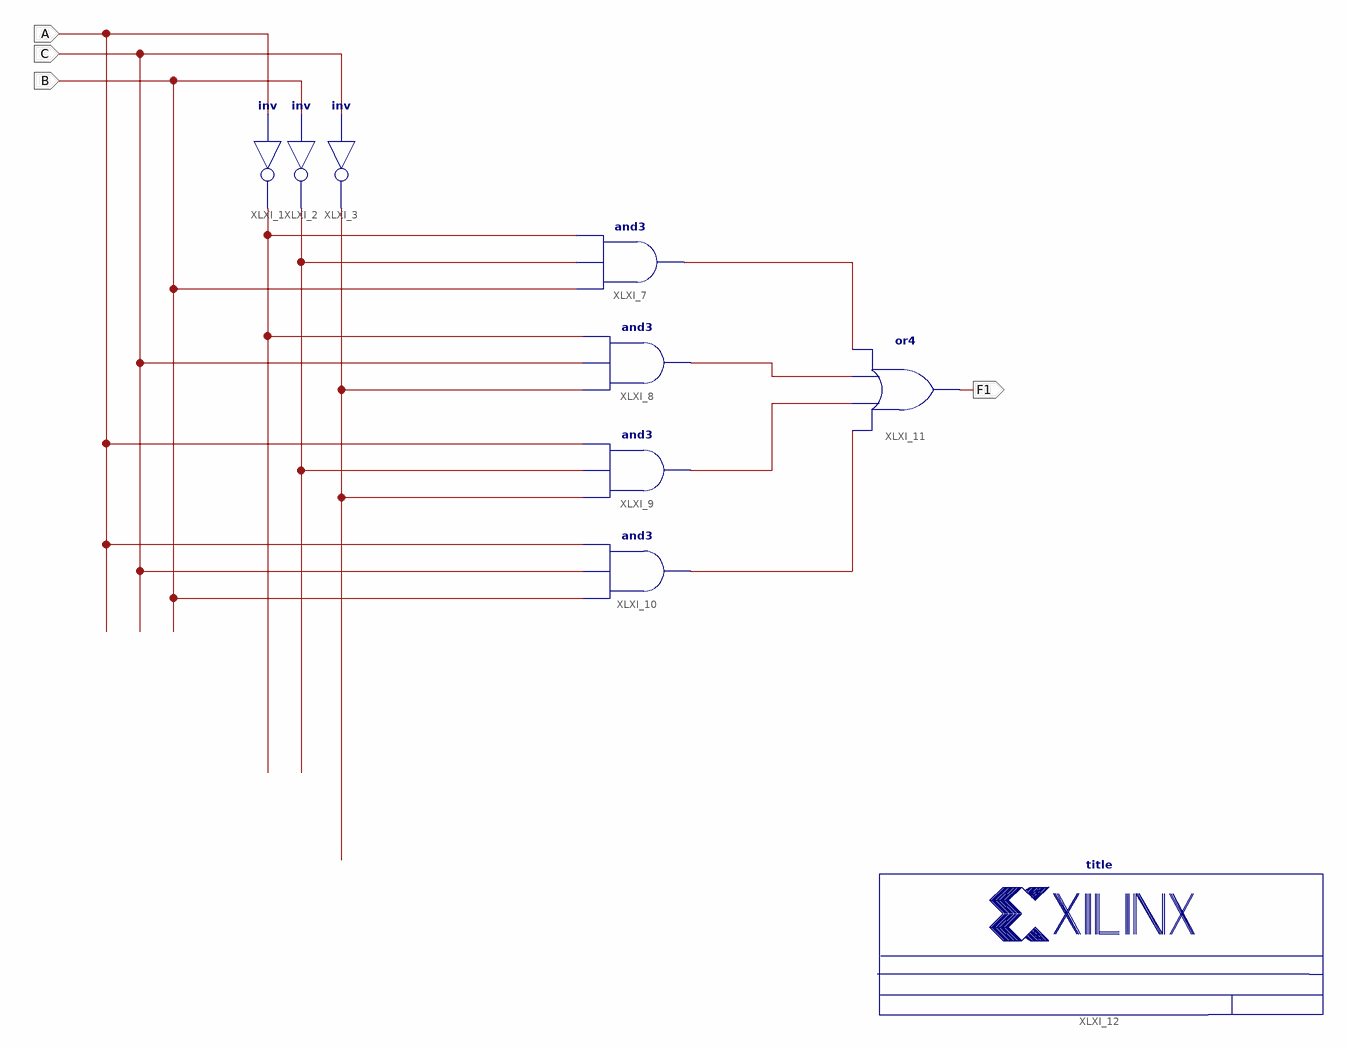
[diagram p0: schematic sheet 1]
// Xilinx ISE schematic basic.sch (artix7) as structural Verilog: 9 symbols, 4 ports
module basic (
  input  B,
  input  C,
  input  A,
  output F1
);

  wire XLXN_4, XLXN_6, XLXN_7, XLXN_10, XLXN_11, XLXN_12, XLXN_13;

  not XLXI_1 (XLXN_7, A);
  not XLXI_2 (XLXN_6, B);
  not XLXI_3 (XLXN_4, C);
  and XLXI_7 (XLXN_10, B, XLXN_6, XLXN_7);
  and XLXI_8 (XLXN_11, XLXN_4, C, XLXN_7);
  and XLXI_9 (XLXN_12, XLXN_4, XLXN_6, A);
  and XLXI_10 (XLXN_13, B, C, A);
  or XLXI_11 (F1, XLXN_13, XLXN_12, XLXN_11, XLXN_10);
  title #(.TitleFieldText("Basic SOP"), .NameFieldText("Prakash saini")) XLXI_12 ();
endmodule
